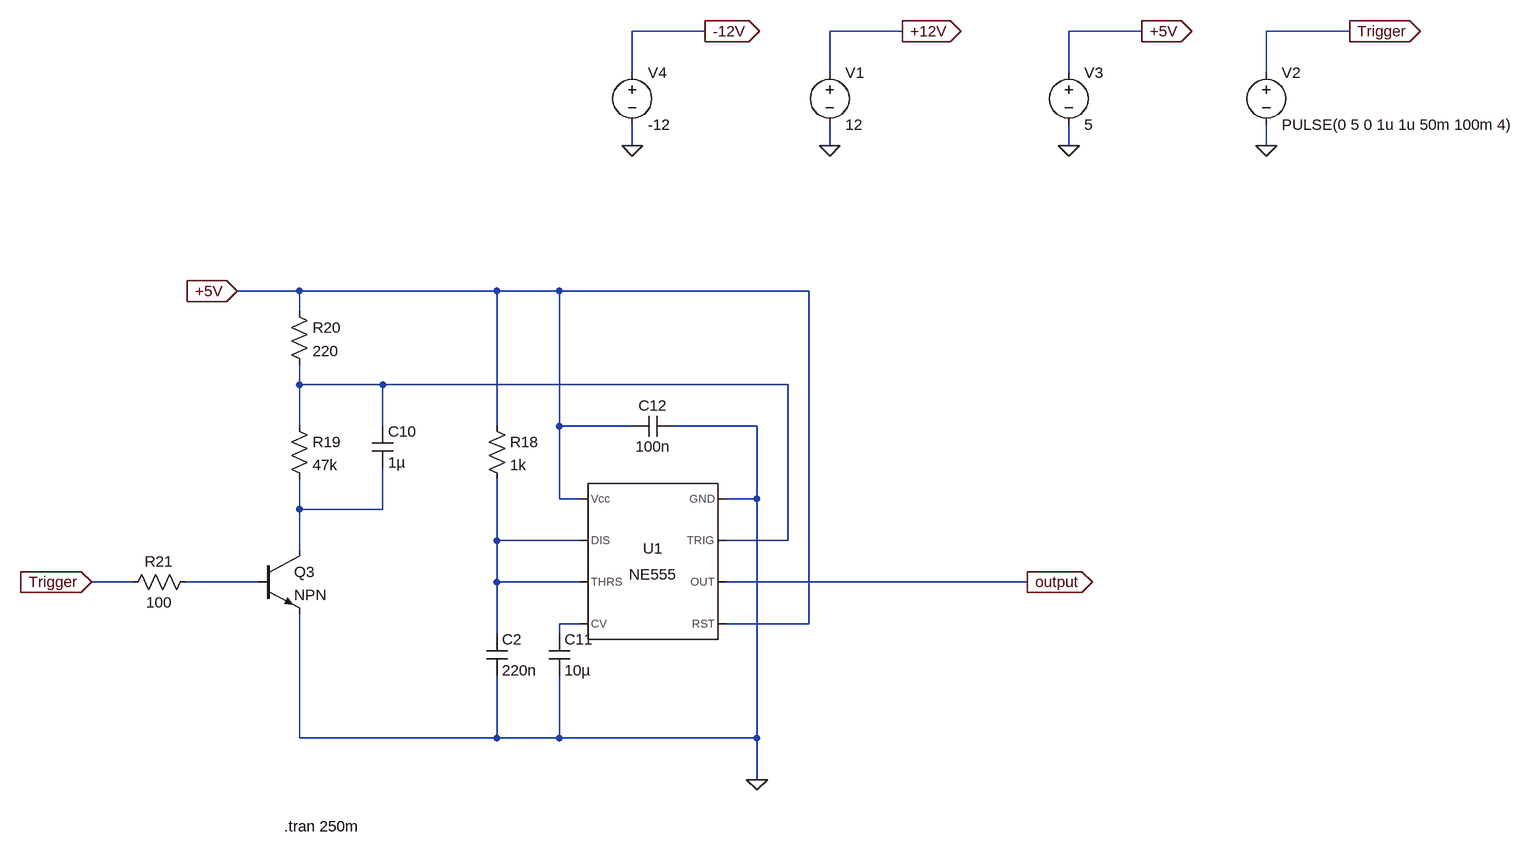
[diagram p0: schematic NE555.asc]
NE555.asc, the LTspice schematic file:
Version 4
SHEET 1 3512 680
WIRE 448 -880 336 -880
WIRE 752 -880 640 -880
WIRE 1120 -880 1008 -880
WIRE 1440 -880 1312 -880
WIRE 336 -816 336 -880
WIRE 640 -816 640 -880
WIRE 1008 -816 1008 -880
WIRE 1312 -816 1312 -880
WIRE 336 -704 336 -736
WIRE 640 -704 640 -736
WIRE 1008 -704 1008 -736
WIRE 1312 -704 1312 -736
WIRE -176 -480 -272 -480
WIRE 128 -480 -176 -480
WIRE 224 -480 128 -480
WIRE 608 -480 224 -480
WIRE -176 -448 -176 -480
WIRE -176 -336 -176 -368
WIRE -48 -336 -176 -336
WIRE 576 -336 -48 -336
WIRE -176 -272 -176 -336
WIRE -48 -272 -48 -336
WIRE 128 -272 128 -480
WIRE 224 -272 224 -480
WIRE 336 -272 224 -272
WIRE 528 -272 400 -272
WIRE 224 -160 224 -272
WIRE 256 -160 224 -160
WIRE 528 -160 528 -272
WIRE 528 -160 480 -160
WIRE -176 -144 -176 -192
WIRE -48 -144 -48 -208
WIRE -48 -144 -176 -144
WIRE 128 -96 128 -192
WIRE 256 -96 128 -96
WIRE 576 -96 576 -336
WIRE 576 -96 480 -96
WIRE -176 -80 -176 -144
WIRE -432 -32 -496 -32
WIRE -240 -32 -352 -32
WIRE 128 -32 128 -96
WIRE 256 -32 128 -32
WIRE 944 -32 480 -32
WIRE 256 32 224 32
WIRE 608 32 608 -480
WIRE 608 32 480 32
WIRE 128 48 128 -32
WIRE 224 48 224 32
WIRE -176 208 -176 16
WIRE 128 208 128 112
WIRE 128 208 -176 208
WIRE 224 208 224 112
WIRE 224 208 128 208
WIRE 528 208 528 -160
WIRE 528 208 224 208
WIRE 528 272 528 208
FLAG 752 -880 +12V
IOPIN 752 -880 Out
FLAG 640 -704 0
FLAG 1440 -880 Trigger
IOPIN 1440 -880 Out
FLAG 1312 -704 0
FLAG 1120 -880 +5V
IOPIN 1120 -880 Out
FLAG 1008 -704 0
FLAG -272 -480 +5V
IOPIN -272 -480 In
FLAG -496 -32 Trigger
IOPIN -496 -32 In
FLAG 944 -32 output
IOPIN 944 -32 Out
FLAG 448 -880 -12V
IOPIN 448 -880 Out
FLAG 336 -704 0
FLAG 528 272 0
SYMBOL voltage 640 -832 R0
WINDOW 123 0 0 Left 0
WINDOW 39 0 0 Left 0
SYMATTR InstName V1
SYMATTR Value 12
SYMBOL voltage 1312 -832 R0
WINDOW 123 0 0 Left 0
WINDOW 39 0 0 Left 0
SYMATTR InstName V2
SYMATTR Value PULSE(0 5 0 1u 1u 50m 100m 4)
SYMBOL Misc\\NE555 368 -64 M0
SYMATTR InstName U1
SYMBOL voltage 1008 -832 R0
WINDOW 123 0 0 Left 0
WINDOW 39 0 0 Left 0
SYMATTR InstName V3
SYMATTR Value 5
SYMBOL res 112 -288 R0
SYMATTR InstName R18
SYMATTR Value 1k
SYMBOL cap 112 48 R0
SYMATTR InstName C2
SYMATTR Value 220n
SYMBOL cap -64 -272 R0
SYMATTR InstName C10
SYMATTR Value 1µ
SYMBOL res -192 -288 R0
SYMATTR InstName R19
SYMATTR Value 47k
SYMBOL res -192 -464 R0
SYMATTR InstName R20
SYMATTR Value 220
SYMBOL npn -240 -80 R0
SYMATTR InstName Q3
SYMBOL res -336 -48 R90
WINDOW 0 0 56 VBottom 2
WINDOW 3 32 56 VTop 2
SYMATTR InstName R21
SYMATTR Value 100
SYMBOL cap 208 48 R0
SYMATTR InstName C11
SYMATTR Value 10µ
SYMBOL cap 400 -288 R90
WINDOW 0 0 32 VBottom 2
WINDOW 3 32 32 VTop 2
SYMATTR InstName C12
SYMATTR Value 100n
SYMBOL voltage 336 -832 R0
WINDOW 123 0 0 Left 0
WINDOW 39 0 0 Left 0
SYMATTR InstName V4
SYMATTR Value -12
TEXT -200 344 Left 2 !.tran 250m

The netlist it stands for:
* NE555.asc
V1 +12V 0 12
V2 Trigger 0 PULSE(0 5 0 1u 1u 50m 100m 4)
XU1 0 N001 output +5V N005 N003 N003 +5V NE555  ; pins GND TRIG OUT RST CV THRS DIS Vcc
V3 +5V 0 5
R18 +5V N003 1k
C2 N003 0 220n
C10 N001 N002 1µ
R19 N001 N002 47k
R20 +5V N001 220
Q3 N002 N004 0 0 NPN
R21 N004 Trigger 100
C11 N005 0 10µ
C12 0 +5V 100n
V4 -12V 0 -12
.model NPN NPN
.model PNP PNP
.lib standard.bjt
.tran 250m
.lib NE555.sub
.backanno
.end